# Altium schematic sheet PWR_GND.SchDoc
size A; SheetNumber: 3; SheetTotal: 3
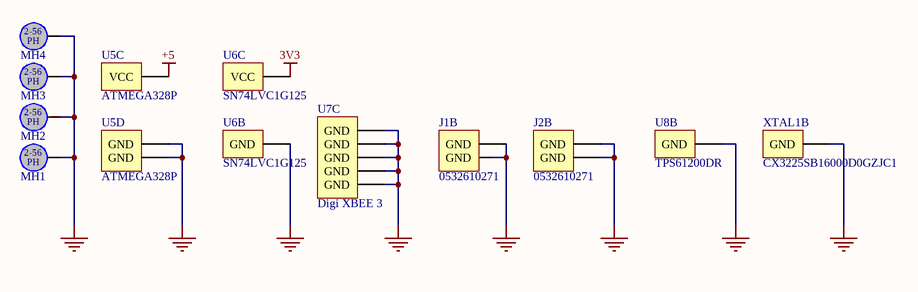
[diagram p0: PWR_GND.SchDoc]

## Parts
J1  0532610271  [MOLEX_53261-0271]  (part B of 2)
J2  0532610271  [MOLEX_53261-0271]  (part B of 2)
MH1  MH_2-56_PanHead_CloseFit  [MH_2-56_PH]  (value not drawn)  (no BOM)
MH2  MH_2-56_PanHead_CloseFit  [MH_2-56_PH]  (value not drawn)  (no BOM)
MH3  MH_2-56_PanHead_CloseFit  [MH_2-56_PH]  (value not drawn)  (no BOM)
MH4  MH_2-56_PanHead_CloseFit  [MH_2-56_PH]  (value not drawn)  (no BOM)
U5  Part Number: ATMEGA328P  [32A_ATM]  (hidden comment: ATMEGA328P_SMD)  (parts C,D of 4)
U6  Part Number: SN74LVC1G125  [SOT-SC70-5]  (hidden comment: SN74LVC1G125DCKR)  (parts B,C of 3)
U7  Part Number: Digi XBEE 3  [XBee_1W_Base]  (hidden comment: XBEE 3 SMD)  (part C of 3)
U8  Part Number: TPS61200DR  [10-VFDFN Exposed Pad]  (hidden comment: TPS61200DR Voltage Boost Regulator)  (part B of 2)
XTAL1  CX3225SB16000D0GZJC1  [OSC SMD-4]  (part B of 2)

## Nets
3V3: U6.5(VCC)
+5: U5.6(VCC)
GND: J1.P1(GND) J1.P2(GND) J2.P1(GND) J2.P2(GND) MH1.1 MH2.1 MH3.1 MH4.1 U5.3(GND) U5.21(GND) U6.3(GND) U7.1(GND) U7.11(GND) U7.22(GND) U7.35(GND) U7.38(GND) U8.9(GND) XTAL1.4(GND)

## Notes on the sheet
- (in symbol MH_2-56_PanHead_CloseFit) 2-56; PH

## Library data of the parts
J1 J2 = 0532610271: 2 Pos Molex Microblade; Supplier 1: Digi-Key; Supplier Part Number 1: WM7620CT-ND; Part Number: 0532610271
MH1-MH4 = MH_2-56_PanHead_CloseFit: Mounting Hole, 2-56 Pan Head, Close Fit Hole; Part Field 1: NP; MANF: None; Part Field 2: NP; MANF P/N: NP; ClassName: Mounting Holes
U5 = ATMEGA328P_SMD: Arduino ATMEGA328 Chip; Supplier 1: Digi-Key; Supplier Part Number 1: ATMEGA328P-AURCT-ND
U6 = SN74LVC1G125DCKR: Single Bus 3-State Buffer; Supplier 1: Digi-Key; Supplier Part Number 1: 296-11603-1-ND
U8 = TPS61200DR Voltage Boost Regulator: Used on Pololu step up regulator board; Supplier 1: Digi-Key; Supplier Part Number 1: 296-21663-1-ND
XTAL1 = CX3225SB16000D0GZJC1: 16MHz Oscillator; Supplier 1: Digi-Key; Supplier Part Number 1: 1253-1698-1-ND; Value: 16MHz
U7 = XBEE 3 SMD: Supplier 1: Digi-Key; Supplier Part Number 1: 602-2200-ND